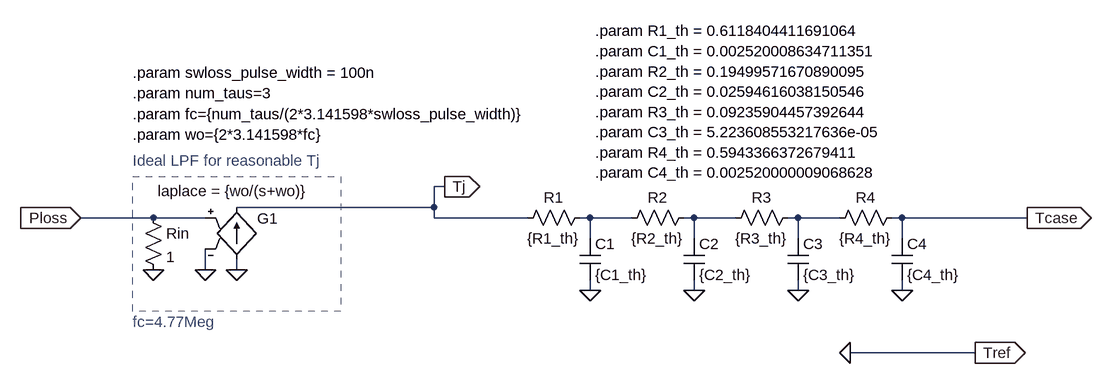
[diagram p0: schematic ThermalNetwork_EPC2305.asc]
ThermalNetwork_EPC2305.asc, the LTspice schematic file:
Version 4.1
SHEET 1 1260 680
WIRE 240 -32 224 -32
WIRE 224 0 224 -32
WIRE 224 0 -80 0
WIRE -208 16 -320 16
WIRE -128 16 -208 16
WIRE 224 16 224 0
WIRE 368 16 224 16
WIRE 464 16 448 16
WIRE 528 16 464 16
WIRE 624 16 608 16
WIRE 688 16 624 16
WIRE 784 16 768 16
WIRE 848 16 784 16
WIRE 944 16 928 16
WIRE 1136 16 944 16
WIRE 464 48 464 16
WIRE 624 48 624 16
WIRE 784 48 784 16
WIRE 944 48 944 16
WIRE -128 96 -128 64
WIRE -80 96 -80 80
WIRE 464 128 464 112
WIRE 624 128 624 112
WIRE 784 128 784 112
WIRE 944 128 944 112
WIRE 1056 224 864 224
FLAG 1136 16 Tcase
IOPIN 1136 16 Out
FLAG -320 16 Ploss
IOPIN -320 16 In
FLAG 464 128 0
FLAG 624 128 0
FLAG 784 128 0
FLAG 944 128 0
FLAG 240 -32 Tj
IOPIN 240 -32 Out
FLAG -208 96 0
FLAG -128 96 0
FLAG -80 96 0
FLAG 1056 224 Tref
IOPIN 1056 224 Out
FLAG 864 224 0
SYMBOL res 464 0 R90
WINDOW 0 0 56 VBottom 2
WINDOW 3 32 56 VTop 2
SYMATTR InstName R1
SYMATTR Value {R1_th}
SYMBOL cap 448 48 R0
SYMATTR InstName C1
SYMATTR Value {C1_th}
SYMBOL res 624 0 R90
WINDOW 0 0 56 VBottom 2
WINDOW 3 32 56 VTop 2
SYMATTR InstName R2
SYMATTR Value {R2_th}
SYMBOL cap 608 48 R0
SYMATTR InstName C2
SYMATTR Value {C2_th}
SYMBOL res 784 0 R90
WINDOW 0 0 56 VBottom 2
WINDOW 3 32 56 VTop 2
SYMATTR InstName R3
SYMATTR Value {R3_th}
SYMBOL cap 768 48 R0
SYMATTR InstName C3
SYMATTR Value {C3_th}
SYMBOL res 944 0 R90
WINDOW 0 0 56 VBottom 2
WINDOW 3 32 56 VTop 2
SYMATTR InstName R4
SYMATTR Value {R4_th}
SYMBOL cap 928 48 R0
SYMATTR InstName C4
SYMATTR Value {C4_th}
SYMBOL res -224 0 R0
SYMATTR InstName Rin
SYMATTR Value 1
SYMBOL g -80 -16 R0
WINDOW 0 32 33 Left 2
WINDOW 3 -121 -9 Left 2
SYMATTR InstName G1
SYMATTR Value laplace = {wo/(s+wo)}
TEXT 472 -272 Left 2 !.param R1_th = 0.6118404411691064\n.param C1_th = 0.002520008634711351\n.param R2_th = 0.19499571670890095\n.param C2_th = 0.02594616038150546\n.param R3_th = 0.09235904457392644\n.param C3_th = 5.223608553217636e-05\n.param R4_th = 0.5943366372679411\n.param C4_th = 0.002520000009068628
TEXT -240 176 Left 2 ;fc=4.77Meg
TEXT -240 -72 Left 2 ;Ideal LPF for reasonable Tj
TEXT -240 -112 Left 2 !.param wo={2*3.141598*fc}
TEXT -240 -208 Left 2 !.param swloss_pulse_width = 100n
TEXT -240 -144 Left 2 !.param fc={num_taus/(2*3.141598*swloss_pulse_width)}
TEXT -240 -176 Left 2 !.param num_taus=3
RECTANGLE Normal 80 160 -240 -48 2

The netlist it stands for:
* ThermalNetwork_EPC2305.asc
R1 N001 Tj {R1_th}
C1 N001 0 {C1_th}
R2 N002 N001 {R2_th}
C2 N002 0 {C2_th}
R3 N003 N002 {R3_th}
C3 N003 0 {C3_th}
R4 Tcase N003 {R4_th}
C4 Tcase 0 {C4_th}
Rin Ploss 0 1
G1 0 Tj Ploss 0 laplace = {wo/(s+wo)}
.param R1_th = 0.6118404411691064
.param C1_th = 0.002520008634711351
.param R2_th = 0.19499571670890095
.param C2_th = 0.02594616038150546
.param R3_th = 0.09235904457392644
.param C3_th = 5.223608553217636e-05
.param R4_th = 0.5943366372679411
.param C4_th = 0.002520000009068628
* fc=4.77Meg
* Ideal LPF for reasonable Tj
.param wo={2*3.141598*fc}
.param swloss_pulse_width = 100n
.param fc={num_taus/(2*3.141598*swloss_pulse_width)}
.param num_taus=3
.backanno
.end